# Altium project pixhawk_debug_adapter_mini.PrjPcb
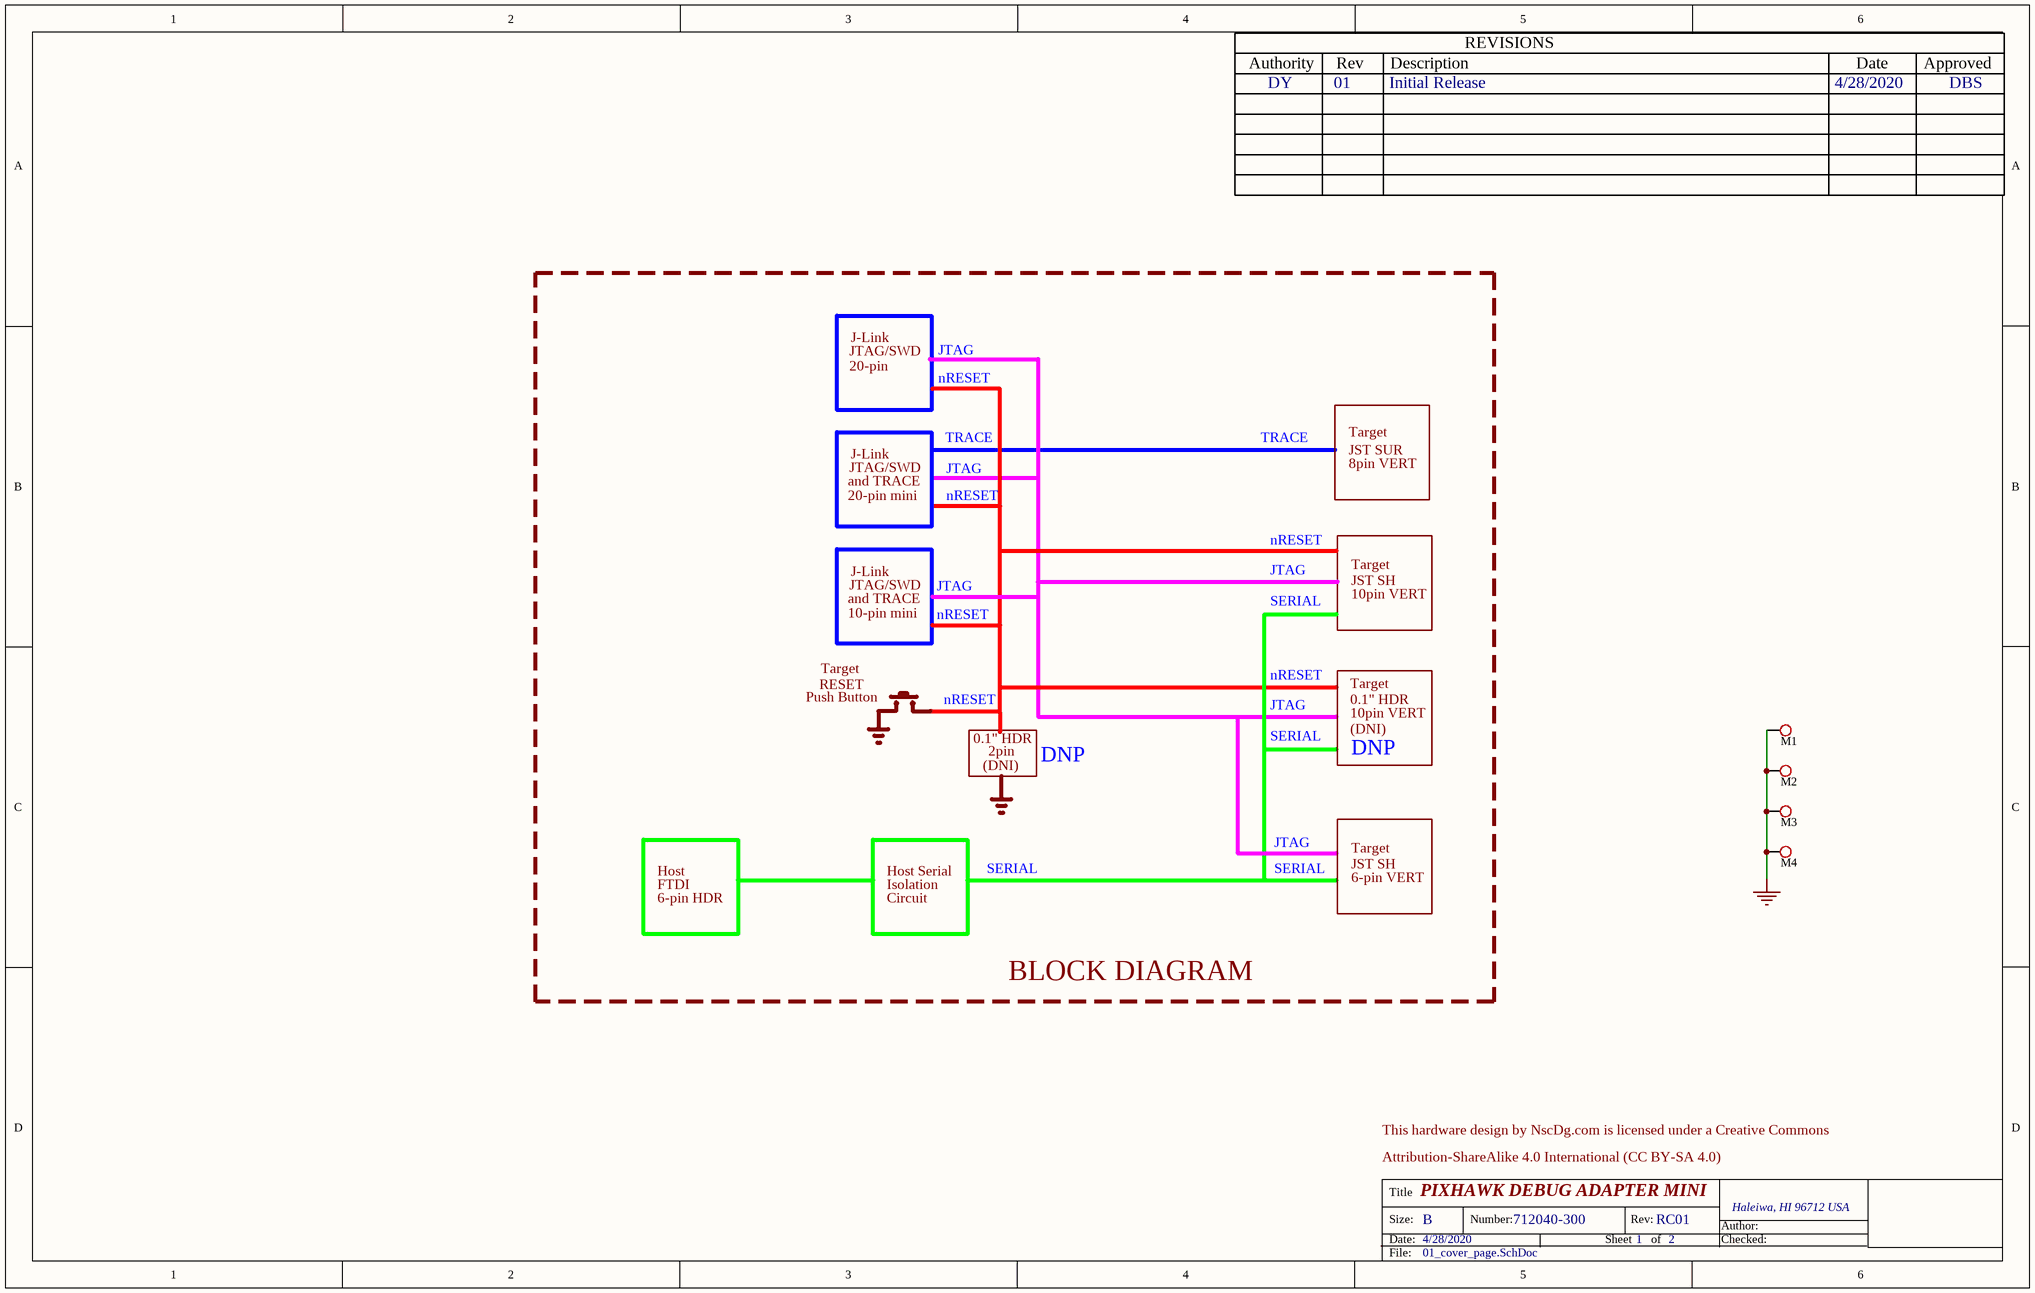
[diagram p0: 01_cover_page.SchDoc]
Proj_Author: Dugan Yoon; Proj_Checked: David Sidrane; Proj_Date: 4/28/2020; Proj_Number: 712040-300; Proj_Organization: © 2016-2020 NscDG; Proj_Revision: RC01; Proj_sheetTotal: 2; Proj_Title: PIXHAWK DEBUG ADAPTER MINI
2 sheets, 26 parts. Net scope: global (net labels, ports and power ports of the same name join across sheets).
Board file: pixhawk_debug_adapter_mini.PcbDoc
Sheets:
  01_cover_page.SchDoc
  02_main.SchDoc

## Sheet 01_cover_page.SchDoc: =Proj_Title
size B; Date: 4/28/2020; CheckedBy: David Sidrane; Author: Dugan Yoon; Organization: © 2016-2020 NscDG; Address1: Haleiwa, HI 96712 USA; DocumentNumber: 712040-300; Revision: RC01; SheetNumber: 1; SheetTotal: 2

### Parts
*  REVISION_BLOCK  (value not drawn)  (graphical)
M1  MOUNT HOLE 3MM 8VIAS THMOUNT_HOLE_3MM_TH  [MOUNT_HOLE_3MM_8via_TH]  (value not drawn)
M2  MOUNT HOLE 3MM 8VIAS THMOUNT_HOLE_3MM_TH  [MOUNT_HOLE_3MM_8via_TH]  (value not drawn)
M3  MOUNT HOLE 3MM 8VIAS THMOUNT_HOLE_3MM_TH  [MOUNT_HOLE_3MM_8via_TH]  (value not drawn)
M4  MOUNT HOLE 3MM 8VIAS THMOUNT_HOLE_3MM_TH  [MOUNT_HOLE_3MM_8via_TH]  (value not drawn)

### Nets
GND: M1.1 M2.1 M3.1 M4.1

### Notes on the sheet
- (near *) DY
- 01
- Initial Release
- 4/28/2020
- DBS
- JTAG/SWD
- 20-pin
- J-Link
- JTAG
- nRESET
- Target
- 20-pin mini
- and TRACE
- TRACE
- JST SUR
- 8pin VERT
- 10-pin mini
- SERIAL
- JST SH
- 10pin VERT
- Push Button
- RESET
- 0.1" HDR
- (DNI)
- 2pin
- DNP
- FTDI
- 6-pin HDR
- Host
- Host Serial
- Isolation
- Circuit
- 6-pin VERT
- BLOCK DIAGRAM
- This hardware design by NscDg.com is licensed under a Creative Commons
- Attribution-ShareAlike 4.0 International (CC BY-SA 4.0)
- Title
- Size:
- Date:
- B
- Number:
- Sheet
- Rev:
- of
- Author:
- Checked:
- File:
- (in symbol REVISION_BLOCK) REVISIONS; Authority; Rev; Description; Date; Approved

### Library data of the parts
M1-M4 = MOUNT_HOLE_3MM_8VIAS_TH: MOUNT HOLE 3MM 8VIAS TH; CATEGORY: Mechanical

## Sheet 02_main.SchDoc: =Proj_Title
size B; Date: 4/28/2020; CheckedBy: David Sidrane; Author: Dugan Yoon; Organization: © 2016-2020 NscDG; Address1: Haleiwa, HI 96712 USA; DocumentNumber: 712040-300; Revision: RC01; SheetNumber: 2; SheetTotal: 2
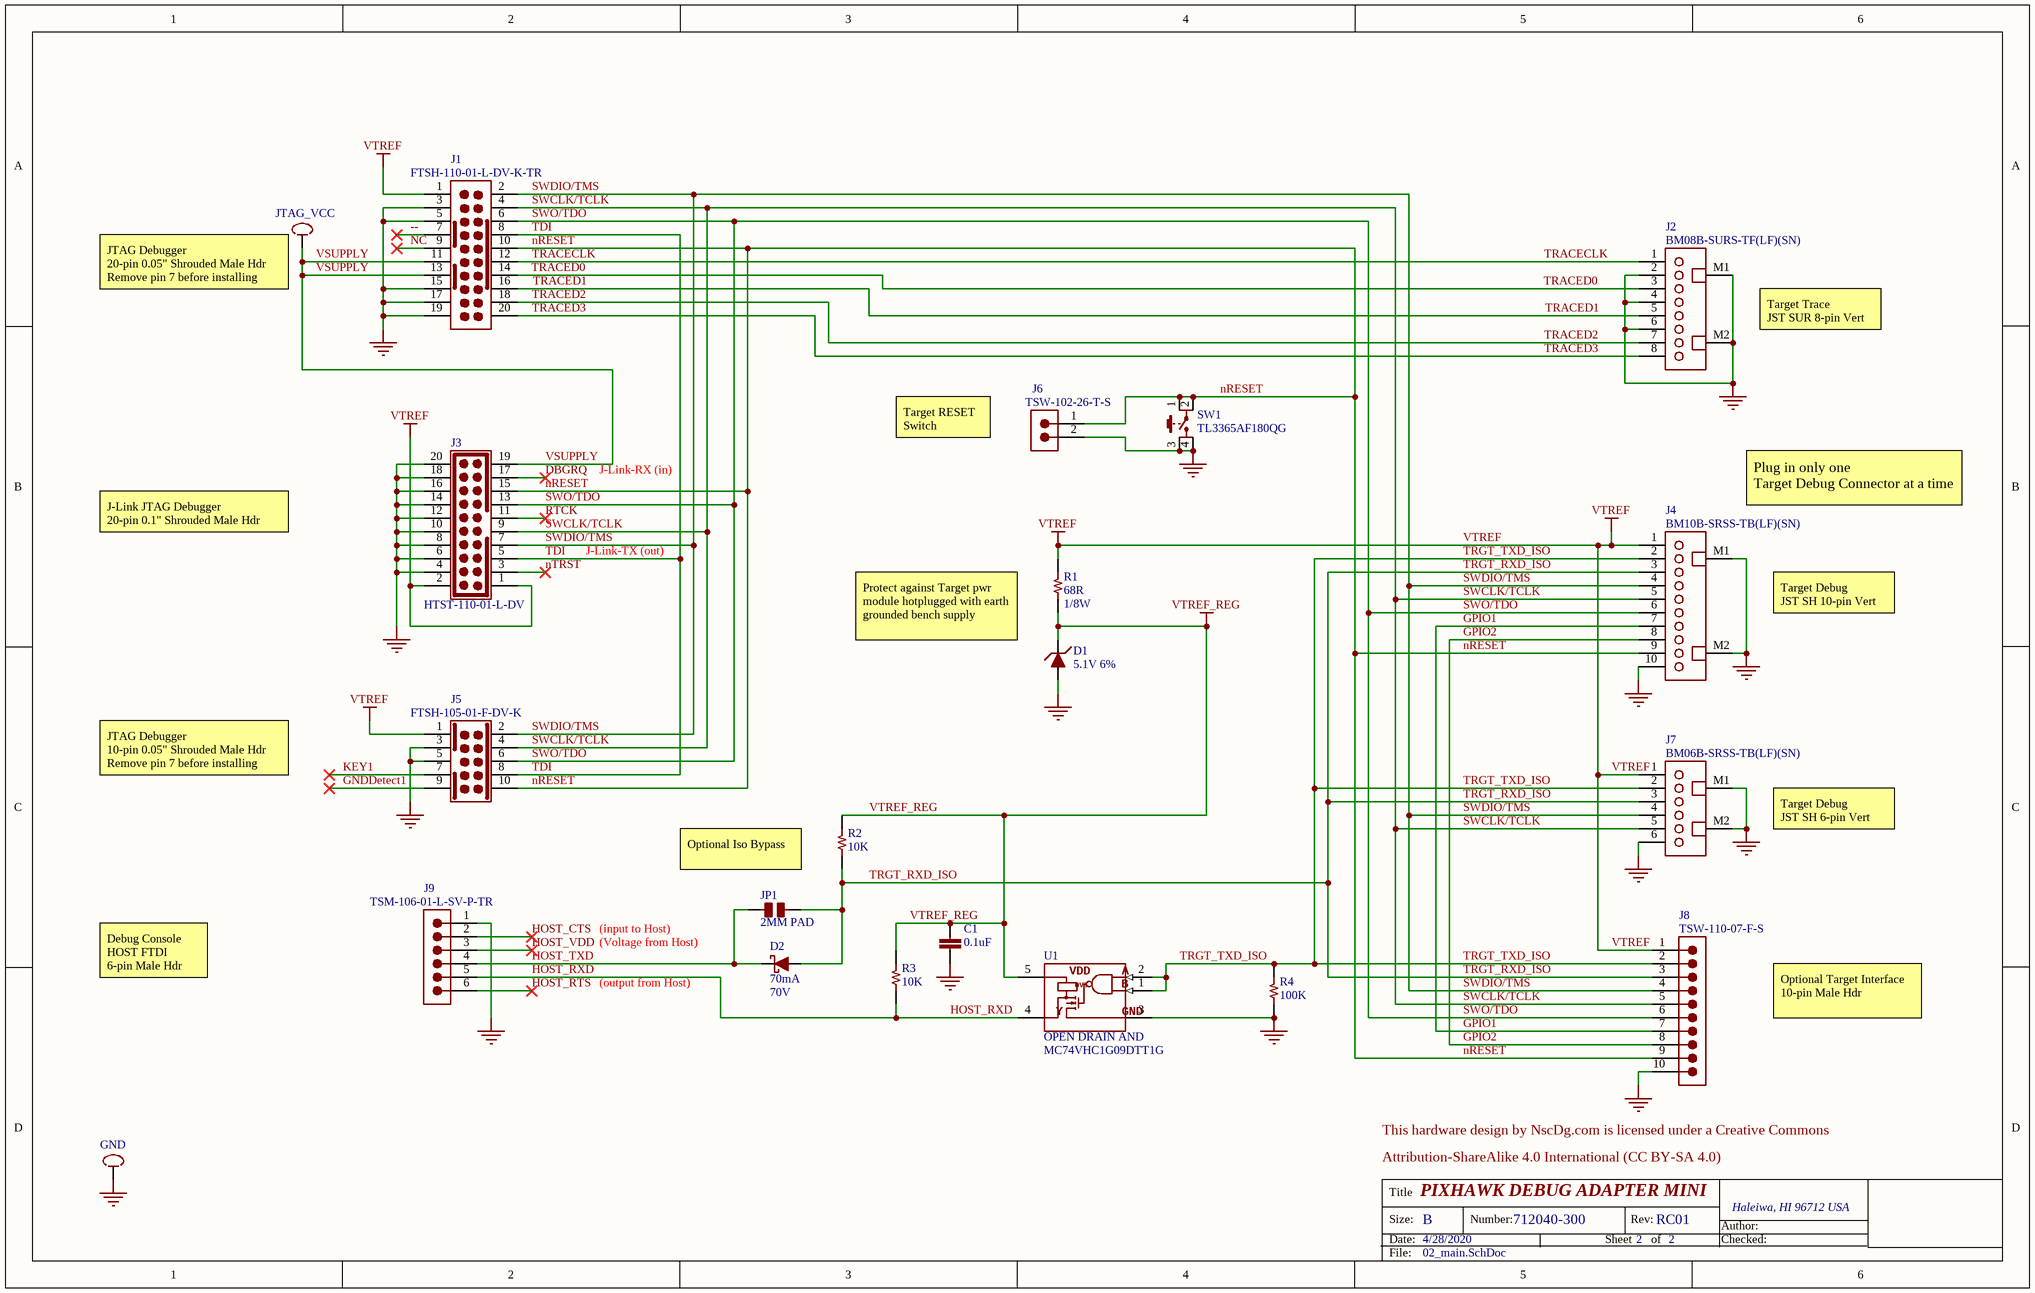
[diagram p1: 02_main.SchDoc]

### Parts
C1  value 0.1uF  [CAPC100X50X56L25N]  (hidden comment: CAP CER 0.1UF 10% 50V X5R 0402)
D1  ID: 5.1V 6%  [SOT23-3P95_230X110L30X43N_DIODE]  (hidden comment: DIODE ZENER 5.1V 225MW SOT23-3)
D2  Current: 70mA  Voltage: 70V  [SODFL120X80X70L30X30]  (hidden comment: DIODE SCHOTTKY 70V 70MA SOD523)
GND  TESTPOINT MINIATURE SMD  [KSTN-5015]  (value not drawn)
J1  Manufacturer Part Number: FTSH-110-01-L-DV-K-TR  [SAMTEC_FTSH-110-01-L-DV-K-TR]  (hidden comment: CONN_HDR_2X10_VERT_SHROUD_FTSH_1.27MM_SMT)
J2  Manufacturer Part Number: BM08B-SURS-TF(LF)(SN)  [JST_BM08B-SURS-TFLFSN]  (hidden comment: CONN HEADER SUR 8POS .8MM VERT SMT)
J3  Manufacturer Part Number: HTST-110-01-L-DV  [SAMTEC_HTST-110-01-F-DV]  (hidden comment: CONN_HDR_2X10_MALE_2.54MM_SHR_SAMTEC_SMD)
J4  Manufacturer Part Number: BM10B-SRSS-TB(LF)(SN)  [JST_BM10B-SRSS-TB]  (hidden comment: CONN HEADER SH 10POS TOP 1MM TIN)
J5  Manufacturer Part Number: FTSH-105-01-F-DV-K  [FTSH-105-01-XXX-DV-K]  (hidden comment: CONN HEADER 10POS DUAL .05" SMD)
J6  Manufacturer Part Number: TSW-102-26-T-S  [SMTC-TSW-102-26-XX-S]  (hidden comment: CONN HEADER 2POS 0.100" (2.54mm) TH)
J7  Manufacturer Part Number: BM06B-SRSS-TB(LF)(SN)  [JST_BM06B-SRSS-TB]  (hidden comment: CONN HEADER SH 6POS TOP 1MM TIN)
J8  Manufacturer Part Number: TSW-110-07-F-S  [HDRV10W64P254_10X1_2054X254H851]  (hidden comment: CONN HEADER 0.100" (2.54mm) 10POS VERT TH)
J9  Manufacturer Part Number: TSM-106-01-L-SV-P-TR  [SAMTEC_TSM-106-01-XX-SV]  (hidden comment: CONN HEADER 6POS 0.100" (2.54mm) SMD)
JP1  Parameter: 2MM PAD  [SHORTING_JUMPER_2MM]  (hidden comment: JUMPER SHORTING BAR 2MM PAD)
JTAG_VCC  TESTPOINT MINIATURE SMD  [KSTN-5015]  (value not drawn)
R1  value 68R  Power: 1/8W  [RESC200X125X70L40N]  (hidden comment: RES SMD 68 OHM 1% 1/8W 0805)
R2  value 10K  [RESC100X50X40L25]  (hidden comment: RES SMD 10K OHM 1% 1/16W 0402)
R3  value 10K  [RESC100X50X40L25]  (hidden comment: RES SMD 10K OHM 1% 1/16W 0402)
R4  value 100K  [RESC100X50X40L25]  (hidden comment: RES SMD 100K OHM 1% 1/16W 0402)
SW1  Manufacturer Part Number: TL3365AF180QG  [SWITCH_SON4P450_420X320X250L75X100N]  (hidden comment: SWITCH TACTILE SPST-NO 0.05A 12V SMT)
U1  ID: OPEN DRAIN AND  Manufacturer Part Number: MC74VHC1G09DTT1G  [SOT23-5P95_270X145L35X35N]  (hidden comment: IC GATE AND 1CH 2-INP 5-TSOP)

### Nets
GND: C1.2 D1.1(A) GND.1 J1.3 J1.5 J1.15 J1.17 J1.19 J2.2 J2.4 J2.6 J2.M1 J2.M2 J3.4 J3.6 J3.8 J3.10 J3.12 J3.14 J3.16 J3.18 J3.20 J4.10 J4.M1 J4.M2 J5.3 J5.5 J6.2 J7.6 J7.M1 J7.M2 J8.10 J9.1 R4.2 SW1.3 SW1.4 U1.3(GND)
VTREF: J1.1 J3.1 J3.2 J4.1 J5.1 J7.1 J8.1 R1.1
VTREF_REG: C1.1 D1.3(K) R1.2 R2.1 R3.1 U1.5(VDD)
--: J1.7
DBGRQ: J3.17
GNDDetect1: J5.9
GPIO1: J4.7 J8.7
GPIO2: J4.8 J8.8
HOST_CTS: J9.2
HOST_RTS: J9.6
HOST_RXD: J9.5 R3.2 U1.4(Y)
HOST_TXD: D2.C J9.4 JP1.1
HOST_VDD: J9.3
KEY1: J5.7
NC: J1.9
nRESET: J1.10 J3.15 J4.9 J5.10 J6.1 J8.9 SW1.1 SW1.2
nTRST: J3.3
RTCK: J3.11
SWCLK/TCLK: J1.4 J3.9 J4.5 J5.4 J7.5 J8.5
SWDIO/TMS: J1.2 J3.7 J4.4 J5.2 J7.4 J8.4
SWO/TDO: J1.6 J3.13 J4.6 J5.6 J8.6
TDI: J1.8 J3.5 J5.8
TRACECLK: J1.12 J2.1
TRACED0: J1.14 J2.3
TRACED1: J1.16 J2.5
TRACED2: J1.18 J2.7
TRACED3: J1.20 J2.8
TRGT_RXD_ISO: D2.A J4.3 J7.3 J8.3 JP1.2 R2.2
TRGT_TXD_ISO: J4.2 J7.2 J8.2 R4.1 U1.1(B) U1.2(A)
VSUPPLY: J1.11 J1.13 J3.19 JTAG_VCC.1

### Notes on the sheet
- (near JTAG_VCC) JTAG Debugger
  20-pin 0.05" Shrouded Male Hdr
  Remove pin 7 before installing
- Target Trace
  JST SUR 8-pin Vert
- Target RESET
  Switch
- J-Link-RX (in)
- Plug in only one
  Target Debug Connector at a time
- J-Link JTAG Debugger
  20-pin 0.1" Shrouded Male Hdr
- J-Link-TX (out)
- Protect against Target pwr
  module hotplugged with earth
  grounded bench supply
- Target Debug
  JST SH 10-pin Vert
- JTAG Debugger
  10-pin 0.05" Shrouded Male Hdr
  Remove pin 7 before installing
- Target Debug
  JST SH 6-pin Vert
- Optional Iso Bypass
- Debug Console
  HOST FTDI
  6-pin Male Hdr
- (input to Host)
- (Voltage from Host)
- (output from Host)
- Optional Target Interface
  10-pin Male Hdr
- (near J8) This hardware design by NscDg.com is licensed under a Creative Commons
- Attribution-ShareAlike 4.0 International (CC BY-SA 4.0)
- Title
- Size:
- Date:
- B
- Number:
- Sheet
- Rev:
- of
- Author:
- Checked:
- File:
- (in symbol IC_GATE_SINGLE_AND_OPEN_DRAIN_5-TSOP) OVT

### Library data of the parts
C1 = CAP_0U1_50V_X5R_0402: Manufacturer: Murata Electronics North America; Manufacturer Part Number: GRM155R61H104KE19D; Voltage - Rated: 50V; Packaging: Cut Tape (CT); Part Status: Active; Tolerance: ±10%; Operating Temperature: -55°C ~ 85°C; Supplier 1: Digi-Key; Supplier Part Number 1: 490-11917-1-ND; Category: Capacitors; Stock 1: 1608921; Pricing 1: 1=0.1, 10=0.065, 100=0.0292, 500=0.02082, 1000=0.01637, 2500=0.01488, 5000=0.01369 (USD); ComponentLink1Description: https://www.digikey.com/products/en/capacitors/ceramic-capacitors/60?k=GRM155R61H104KE19D&k=&pkeyword=GRM155R61H104KE19D&pv7=2&sf=0&quantity=&ColumnSort=0&page=1&pageSize=25; ComponentLink1URL: https://www.digikey.com/products/en/capacitors/ceramic-capacitors/60?k=GRM155R61H104KE19D&k=&pkeyword=GRM155R61H104KE19D&pv7=2&sf=0&quantity=&ColumnSort=0&page=1&pageSize=25
D1 = DIODE_ZENER_5.1V_SOT23-3: Manufacturer: ON Semiconductor; Manufacturer Part Number: BZX84C5V1LT3G; Packaging: Cut Tape (CT); Part Status: Active; Operating Temperature: -65°C ~ 150°C (TJ); Supplier 1: Digi-Key; Supplier Part Number 1: BZX84C5V1LT3GOSCT-ND; Category: Circuit Protection; Stock 1: 21912; Pricing 1: 1= 0.13 (USD); ComponentLink1Description: https://www.digikey.com/product-detail/en/on-semiconductor/BZX84C5V1LT3G/BZX84C5V1LT3GOSCT-ND/3462252; ComponentLink1URL: https://www.digikey.com/product-detail/en/on-semiconductor/BZX84C5V1LT3G/BZX84C5V1LT3GOSCT-ND/3462252
D2 = DIODE_SCHOTTKY_BAS70_SOD523_SMT: Manufacturer: STMicroelectronics; Manufacturer Part Number: BAS70KFILM; Packaging: Cut Tape (CT); Part Status: Active; Supplier 1: Digi-Key; Supplier Part Number 1: 497-5695-1-ND; Category: Discrete Semiconductor Products; Stock 1: 20067; Pricing 1: 1=0.28, 10=0.23, 100=0.122, 500=0.08028, 1000=0.05459 (USD); ComponentLink1Description: https://www.digikey.com/product-detail/en/stmicroelectronics/BAS70KFILM/497-5695-1-ND/1299948; ComponentLink1URL: https://www.digikey.com/product-detail/en/stmicroelectronics/BAS70KFILM/497-5695-1-ND/1299948
GND JTAG_VCC = TESTPOINT_MINIATURE_SMD: Manufacturer: Keystone Electronics; Manufacturer Part Number: 5015; Supplier 1: Digi-Key; Supplier Part Number 1: 36-5015CT-ND; CATEGORY: Test and Measurement; ComponentLink1Description: https://www.digikey.com/product-detail/en/keystone-electronics/5015/36-5015CT-ND/278886; ComponentLink1URL: https://www.digikey.com/product-detail/en/keystone-electronics/5015/36-5015CT-ND/278886
J1 = CONN_HDR_2X10_SHROUD_1.27MM_SMT: Manufacturer: Samtec Inc.; System: Connector; Packaging: Cut Tape (CT); Part Status: Active; Operating Temperature: -55°C ~ 125°C; Supplier 1: Digi-Key; Supplier Part Number 1: SAM13960CT-ND; Category: Connectors, Interconnects; Stock 1: 73; Pricing 1: 1=5.36 (USD); ComponentLink1Description: https://www.digikey.com/products/en/connectors-interconnects/rectangular-connectors-headers-male-pins/314?k=FTSH-110-01-L-DV-K&k=&pkeyword=FTSH-110-01-L-DV-K&sv=0&pv5=362515&sf=0&FV=-8%7C314%2C7%7C2&quantity=&ColumnSort=0&page=1&pageSize=25; ComponentLink1URL: https://www.digikey.com/products/en/connectors-interconnects/rectangular-connectors-headers-male-pins/314?k=FTSH-110-01-L-DV-K&k=&pkeyword=FTSH-110-01-L-DV-K&sv=0&pv5=362515&sf=0&FV=-8%7C314%2C7%7C2&quantity=&ColumnSort=0&page=1&pageSize=25
J2 = CONN_JST_SUR_8PIN_VERT_SMT: Manufacturer: JST Sales America Inc.; Voltage - Rated: 30V; System: Connector; Packaging: Tape & Reel (TR); Part Status: Active; Operating Temperature: -25°C ~ 85°C; Supplier 1: Digi-Key; Supplier Part Number 1: 455-3578-1-ND; Category: Connectors, Interconnects; Stock 1: 2227; Pricing 1: 1=0.73 (USD); ComponentLink1Description: https://www.digikey.com/products/en/connectors-interconnects/rectangular-connectors-headers-male-pins/314?k=bm08bsur&k=&pkeyword=bm08bsur&sv=0&pv7=2&sf=0&quantity=&ColumnSort=0&page=1&pageSize=25; ComponentLink1URL: https://www.digikey.com/products/en/connectors-interconnects/rectangular-connectors-headers-male-pins/314?k=bm08bsur&k=&pkeyword=bm08bsur&sv=0&pv7=2&sf=0&quantity=&ColumnSort=0&page=1&pageSize=25
J3 = CONN_HDR_2X10_MALE_2.54MM_SHR_SAMTEC_SMD: Manufacturer: Samtec Inc.; System: Connector; Packaging: Tray; Part Status: Active; Operating Temperature: -65°C ~ 125°C; Supplier 1: Digi-Key; Supplier Part Number 1: SAM10529-ND; Category: Connectors, Interconnects; Stock 1: 118; Pricing 1: 1=2.60 (USD); ComponentLink1Description: https://www.digikey.com/product-detail/en/samtec-inc/HTST-110-01-L-DV/SAM10529-ND/6468733; ComponentLink1URL: https://www.digikey.com/product-detail/en/samtec-inc/HTST-110-01-L-DV/SAM10529-ND/6468733
J4 = CONN_JST_SH_10PIN_VERT_SMT: Manufacturer: JST Sales America Inc.; Voltage - Rated: 50V; System: Connector; Packaging: Cut Tape (CT); Part Status: Active; Operating Temperature: -25°C ~ 85°C; Supplier 1: Digi-Key; Supplier Part Number 1: 455-1796-1-ND; Category: Connectors, Interconnects; Stock 1: 62595; Pricing 1: 1=1.06, 10=9.32, 100=0.8037, 500=0.65758, 1000=0.58452 (USD); ComponentLink1Description: https://www.digikey.com/products/en/connectors-interconnects/rectangular-connectors-headers-male-pins/314?k=bm10b-srss&k=&pkeyword=bm10b-srss&pv1989=0&sf=0&FV=ffe0013a%2C1c0002&quantity=&ColumnSort=0&page=1&pageSize=25; ComponentLink1URL: https://www.digikey.com/products/en/connectors-interconnects/rectangular-connectors-headers-male-pins/314?k=bm10b-srss&k=&pkeyword=bm10b-srss&pv1989=0&sf=0&FV=ffe0013a%2C1c0002&quantity=&ColumnSort=0&page=1&pageSize=25
J5 = CONN_HDR_2X5_MALE_1.27MM_SMT: Manufacturer: Samtec Inc.; System: Connector; Packaging: Tube; Part Status: Active; Operating Temperature: -55°C ~ 125°C; Supplier 1: Digi-Key; Supplier Part Number 1: SAM8796-ND; Category: Connectors, Interconnects; Stock 1: 30769; Pricing 1: 1=2.9, 10=2.784, 100=2.32, 500=1.972, 1000=1.682, 5000=1.508 (USD)
J6 = CONN_HDR_1X2_MALE_2.54MM_TH: Manufacturer: Samtec Inc.; System: Connector; Packaging: Bulk; Part Status: Active; Operating Temperature: -55°C ~ 105°C; Supplier 1: Digi-Key; Supplier Part Number 1: TSW-102-26-T-S-ND; Category: Connectors, Interconnects; Stock 1: 0; Pricing 1: 1=0.22 (USD); ComponentLink1Description: https://www.digikey.com/product-detail/en/samtec-inc/TSW-102-26-T-S/TSW-102-26-T-S-ND/6691583; ComponentLink1URL: https://www.digikey.com/product-detail/en/samtec-inc/TSW-102-26-T-S/TSW-102-26-T-S-ND/6691583
J7 = CONN_JST_SH_6PIN_VERT_SMT: Manufacturer: JST Sales America Inc.; Voltage - Rated: 50V; System: Connector; Packaging: Cut Tape (CT); Part Status: Active; Operating Temperature: -25°C ~ 85°C; Supplier 1: Digi-Key; Supplier Part Number 1: 455-2875-1-ND; Category: Connectors, Interconnects; Stock 1: 72375; Pricing 1: 1=0.76, 10=0.672, 100=0.5797, 500=0.47428 (USD); ComponentLink1Description: https://www.digikey.com/products/en/connectors-interconnects/rectangular-connectors-headers-male-pins/314?k=bm06b-srss&k=&pkeyword=bm06b-srss&sv=0&pv5=15518&sf=0&FV=1c0002%2Cffe0013a%2C1f140000&quantity=&ColumnSort=0&page=1&pageSize=25; ComponentLink1URL: https://www.digikey.com/products/en/connectors-interconnects/rectangular-connectors-headers-male-pins/314?k=bm06b-srss&k=&pkeyword=bm06b-srss&sv=0&pv5=15518&sf=0&FV=1c0002%2Cffe0013a%2C1f140000&quantity=&ColumnSort=0&page=1&pageSize=25
J8 = CONN_HDR_1X10_MALE_2.54MM_TH: Manufacturer: Samtec; System: Connector; Category: Connectors, Interconnects; Supplier 1: Digi-Key; Supplier Part Number 1: SAM10351-ND; Stock 1: 4178; Pricing 1: 1=0.56, 10=0.525 (USD); Packaging: Bulk; Part Status: Active; Operating Temperature: -55°C ~ 125°C; ComponentLink1Description: https://www.digikey.com/product-detail/en/samtec-inc/TSW-110-07-F-S/SAM10351-ND/6679088; ComponentLink1URL: https://www.digikey.com/product-detail/en/samtec-inc/TSW-110-07-F-S/SAM10351-ND/6679088
J9 = CONN_HDR_1X6_MALE_2.54MM_SMD: Manufacturer: Samtec; System: Connector; Category: Connectors, Interconnects; Supplier 1: Digi-Key; Supplier Part Number 1: SAM14846CT-ND; Stock 1: 78; Pricing 1: 1=1.57 (USD); Packaging: Cut Tape (CT); Part Status: Active; Operating Temperature: -55°C ~ 125°C; ComponentLink1Description: https://www.digikey.com/products/en/connectors-interconnects/rectangular-connectors-headers-male-pins/314?k=&pkeyword=&sv=0&pv1792=64614&sf=1&FV=28%7C353507%2C69%7C409393%2C88%7C249730%2C90%7C39665%2C512%7C371353%2C1790%7C9726%2C1791%7C350796%2C1989%7C0%2C2011%7C406666%2C2021%7C417859%2C-8%7C314%2C-1%7C612%2C7%7C2%2C2025%7C15230&quantity=&ColumnSort=0&page=1&pageSize=25; ComponentLink1URL: https://www.digikey.com/products/en/connectors-interconnects/rectangular-connectors-headers-male-pins/314?k=&pkeyword=&sv=0&pv1792=64614&sf=1&FV=28%7C353507%2C69%7C409393%2C88%7C249730%2C90%7C39665%2C512%7C371353%2C1790%7C9726%2C1791%7C350796%2C1989%7C0%2C2011%7C406666%2C2021%7C417859%2C-8%7C314%2C-1%7C612%2C7%7C2%2C2025%7C15230&quantity=&ColumnSort=0&page=1&pageSize=25
JP1 = JUMPER_SHORTING_BAR_2MM_PAD: Category: Mechanical
R1 = RES_68R_1%_1/8W_0805: Manufacturer: Yageo; Manufacturer Part Number: RC0805FR-0768RL; Packaging: Cut Tape (CT); Part Status: Active; Tolerance: ±1%; Operating Temperature: -55°C ~ 155°C; Supplier 1: Digi-Key; Supplier Part Number 1: 311-68.0CRCT-ND; Category: Resistors; Stock 1: 9649084; Pricing 1: 1=0.1, 10=0.022, 100=0.0088, 1000=0.00396, 2500=0.00344 (USD); ComponentLink1Description: https://www.digikey.com/products/en/resistors/chip-resistor-surface-mount/52?k=&pkeyword=&sv=0&pv2=3&sf=0&FV=fffc000d%2C1c0002%2C1f140000%2Cmu68+Ohms%7C2085%2Cffe00034%2Cffec1104%2Cc0001%2C14203b%2C2b80016&quantity=&ColumnSort=0&page=1&pageSize=25; ComponentLink1URL: https://www.digikey.com/products/en/resistors/chip-resistor-surface-mount/52?k=&pkeyword=&sv=0&pv2=3&sf=0&FV=fffc000d%2C1c0002%2C1f140000%2Cmu68+Ohms%7C2085%2Cffe00034%2Cffec1104%2Cc0001%2C14203b%2C2b80016&quantity=&ColumnSort=0&page=1&pageSize=25
R2 R3 = RES_10K_1%_1/16W_0402: Manufacturer: Yageo; Manufacturer Part Number: RC0402FR-0710KL; Packaging: Cut Tape (CT); Part Status: Active; Tolerance: ±1%; Operating Temperature: -55°C ~ 155°C; Supplier 1: Digi-Key; Supplier Part Number 1: 311-10.0KLRCT-ND; Category: Resistors; Stock 1: 37996194; Pricing 1: 1=0.1, 10=0.014, 100=0.0056, 1000=0.00253, 2500=0.0022, 5000=0.00181 (USD); Power: 1/16W; ComponentLink1Description: https://www.digikey.com/products/en?keywords=311-10.0KLRCT-ND; ComponentLink1URL: https://www.digikey.com/products/en?keywords=311-10.0KLRCT-ND
R4 = RES_100K_1%_1/16W_0402: Manufacturer: Yageo; Manufacturer Part Number: RC0402FR-07100KL; Packaging: Cut Tape (CT); Part Status: Active; Tolerance: ±1%; Operating Temperature: -55°C ~ 155°C; Supplier 1: Digi-Key; Supplier Part Number 1: 311-100KLRCT-ND; Category: Resistors; Stock 1: 16720425; Pricing 1: 1=0.1, 10=0.014, 100=0.0056, 1000=0.00253, 2500=0.0022, 5000=0.00181 (USD); Power: 1/16W; ComponentLink1Description: https://www.digikey.com/products/en/resistors/chip-resistor-surface-mount/52?k=RC0402FR-07100KL&k=&pkeyword=RC0402FR-07100KL&pv7=2&sf=0&quantity=&ColumnSort=0&page=1&pageSize=25; ComponentLink1URL: https://www.digikey.com/products/en/resistors/chip-resistor-surface-mount/52?k=RC0402FR-07100KL&k=&pkeyword=RC0402FR-07100KL&pv7=2&sf=0&quantity=&ColumnSort=0&page=1&pageSize=25
SW1 = SWITCH_SPST_OFF_MOM_NO_SMT: Manufacturer: E-Switch; Voltage - Rated: 0.05A @ 12VDC; Packaging: Cut Tape (CT); Part Status: Active; Operating Temperature: -20°C ~ 70°C; Supplier 1: Digi-Key; Supplier Part Number 1: EG5384CT-ND; Category: Switches; Stock 1: 73674; Pricing 1: 1=0.34, 10=0.333, 25=0.3208, 50=0.3088, 100=0.297, 250=0.27324, 500=0.2376, 1000=0.20196 (USD); ComponentLink1Description: https://www.digikey.com/product-detail/en/e-switch/TL3365AF180QG/EG5384CT-ND/5964420; ComponentLink1URL: https://www.digikey.com/product-detail/en/e-switch/TL3365AF180QG/EG5384CT-ND/5964420; ComponentLink2Description: https://www.mouser.com/ProductDetail/ALPS/SKRPABE010?qs=%2fha2pyFaduiSGOmjM3i%252bt9v%2fAzS%2f%2fo3A%2fnB8kYeCJaQ%3d; ComponentLink2URL: https://www.mouser.com/ProductDetail/ALPS/SKRPABE010?qs=%2fha2pyFaduiSGOmjM3i%252bt9v%2fAzS%2f%2fo3A%2fnB8kYeCJaQ%3d
U1 = IC_GATE_SINGLE_AND_OPEN_DRAIN_5-TSOP: Manufacturer: ON Semiconductor; Packaging: Cut Tape (CT); Part Status: Active; Operating Temperature: -55°C ~ 125°C; Supplier 1: Digi-Key; Supplier Part Number 1: MC74VHC1G09DTT1GOSCT-ND; Category: Integrated Circuits (ICs); Stock 1: 5436; Pricing 1: 1=0.34, 10=0.28, 100=0.1485, 500=0.09772, 1000=0.06645 (USD); ComponentLink1Description: https://www.digikey.com/product-detail/en/on-semiconductor/MC74VHC1G09DTT1G/MC74VHC1G09DTT1GOSCT-ND/2120980; ComponentLink1URL: https://www.digikey.com/product-detail/en/on-semiconductor/MC74VHC1G09DTT1G/MC74VHC1G09DTT1GOSCT-ND/2120980

## Nets that join several sheets
GND: 01_cover_page (M1.1 M2.1 M3.1 M4.1), 02_main (37 pins)

## Assembly variants
Production: not fitted J6 J8 JTAG_VCC